# Altium schematic sheet Digitalizador_RPi.SchDoc
size A1; Organization: Altium Limited; Address1: L3, 12a Rodborough Rd; Address2: Frenchs Forest; Address3: NSW; Address4: Australia 2086
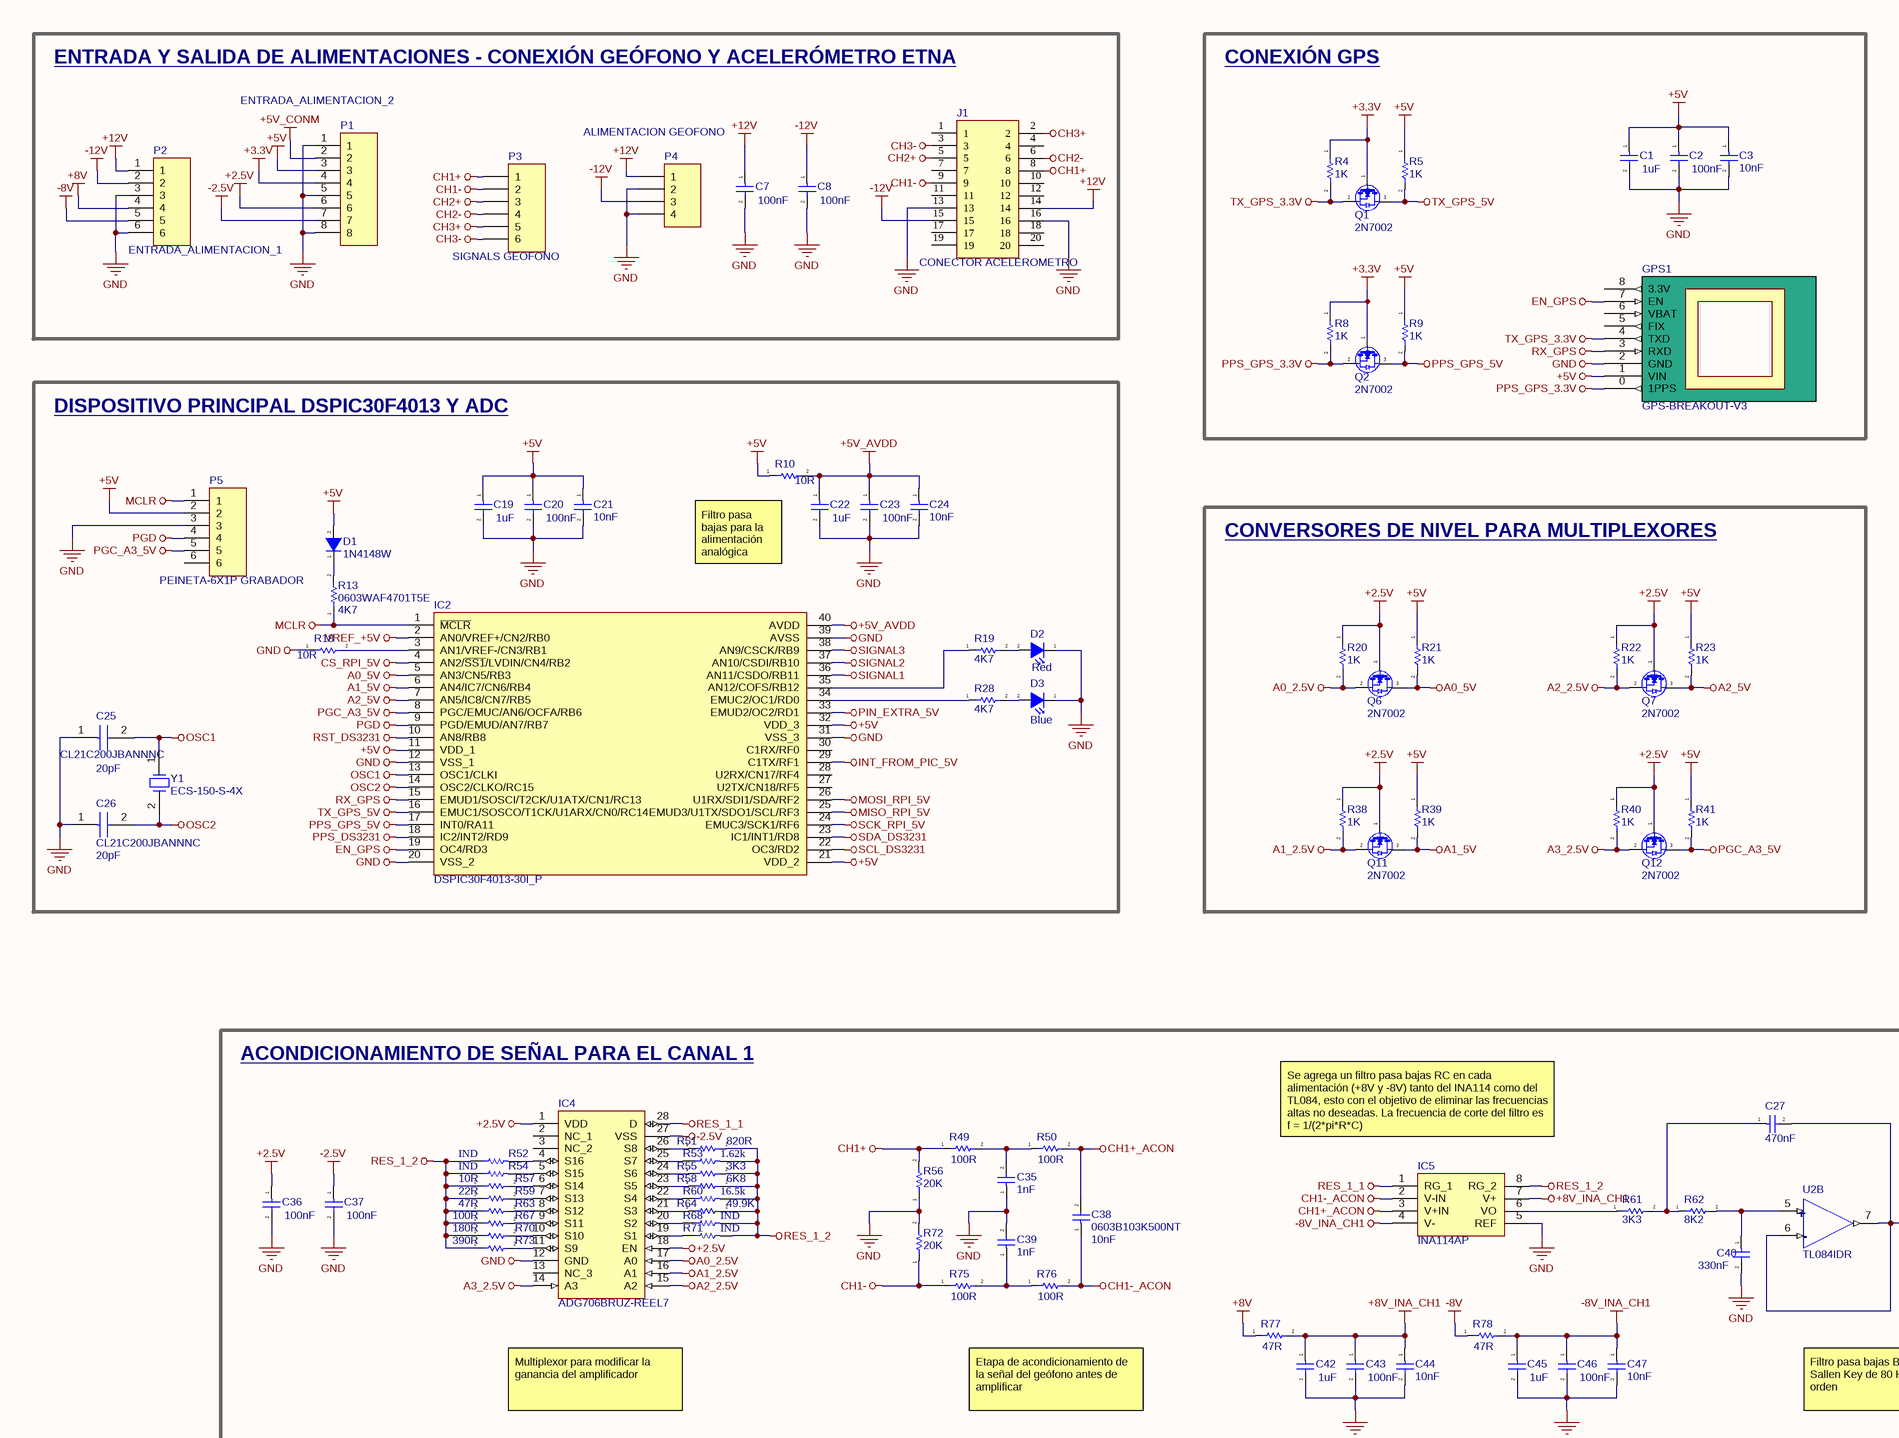
[diagram p0: Digitalizador_RPi.SchDoc, top left]
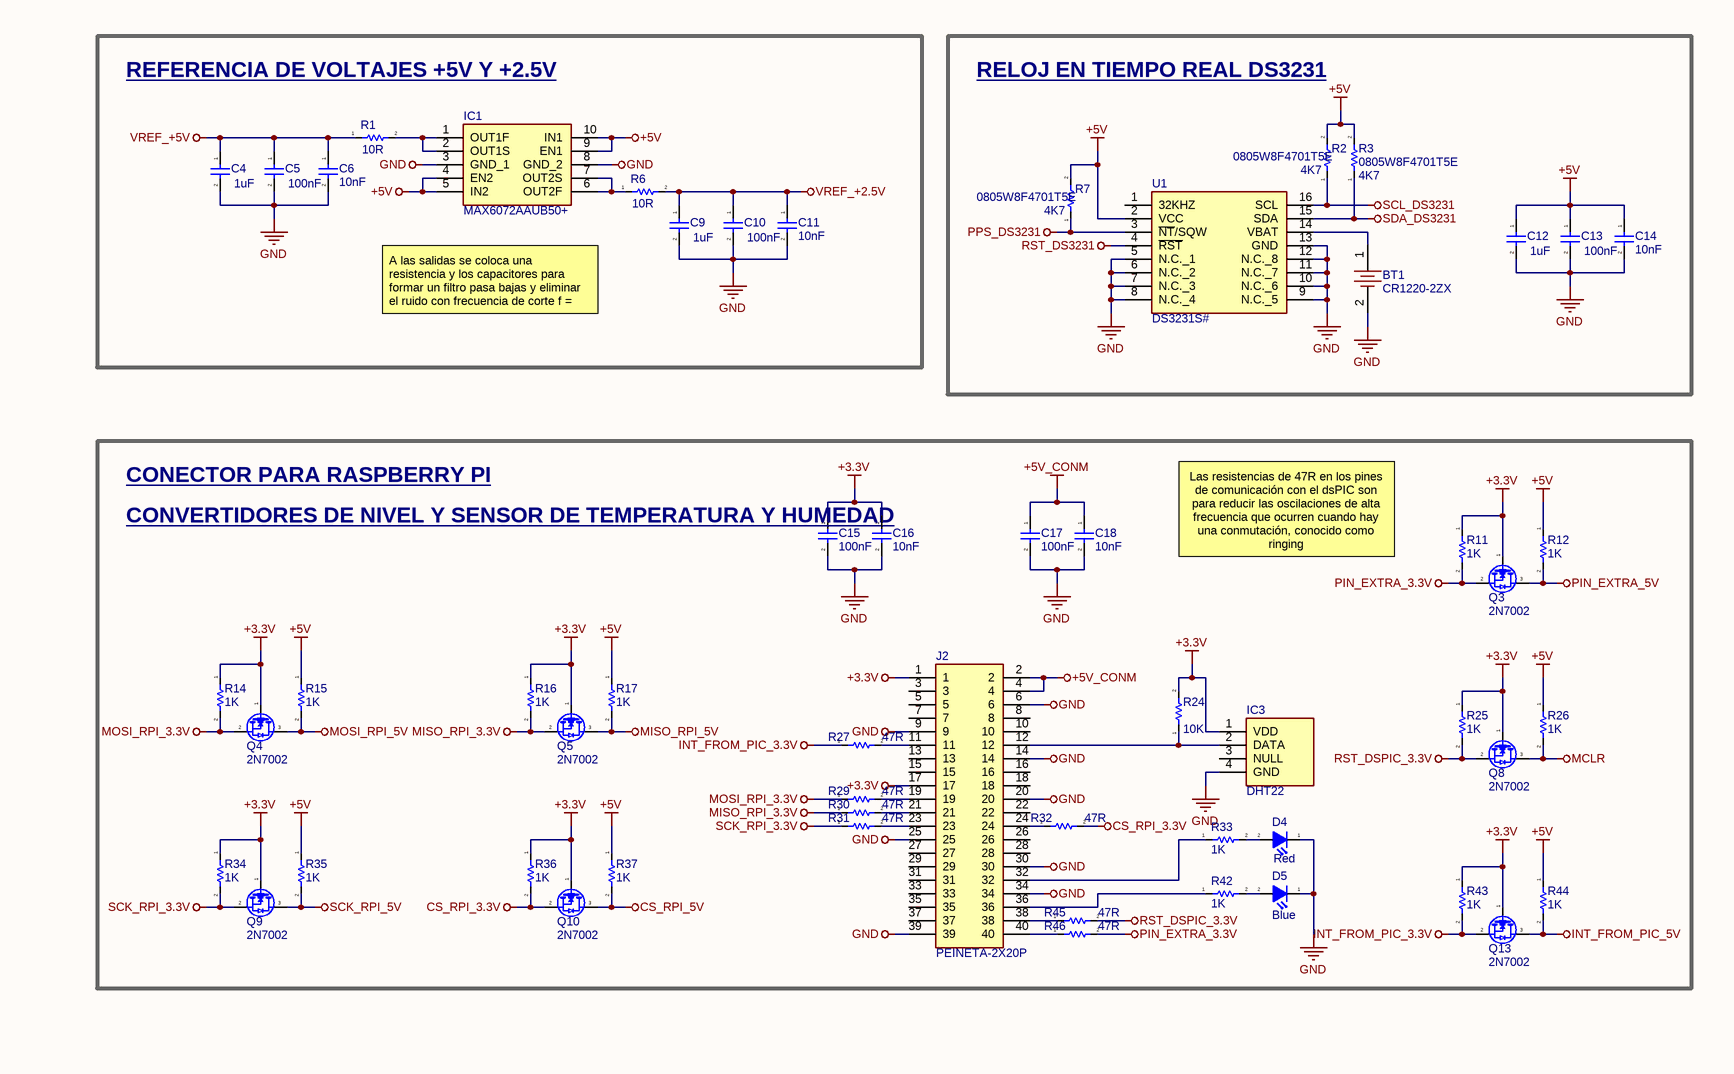
[diagram p1: Digitalizador_RPi.SchDoc, top right]
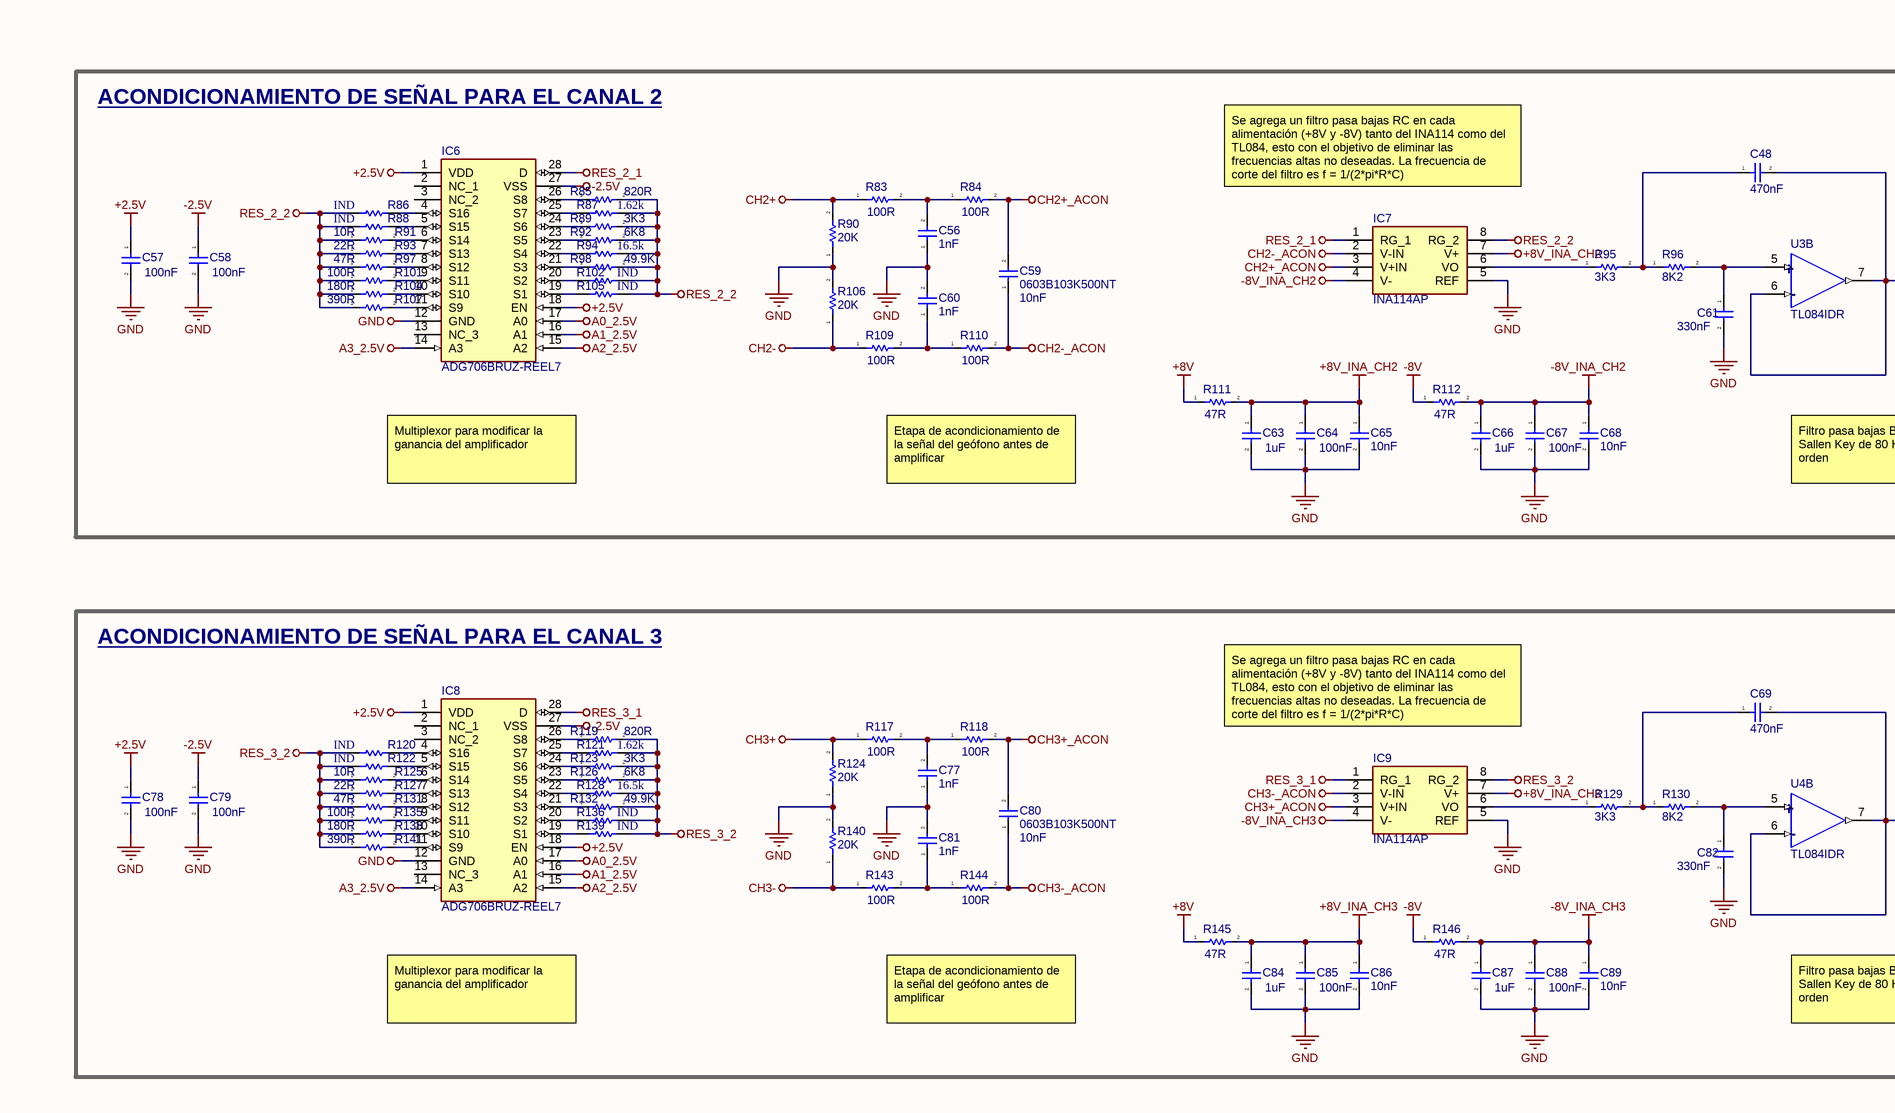
[diagram p2: Digitalizador_RPi.SchDoc, bottom left]
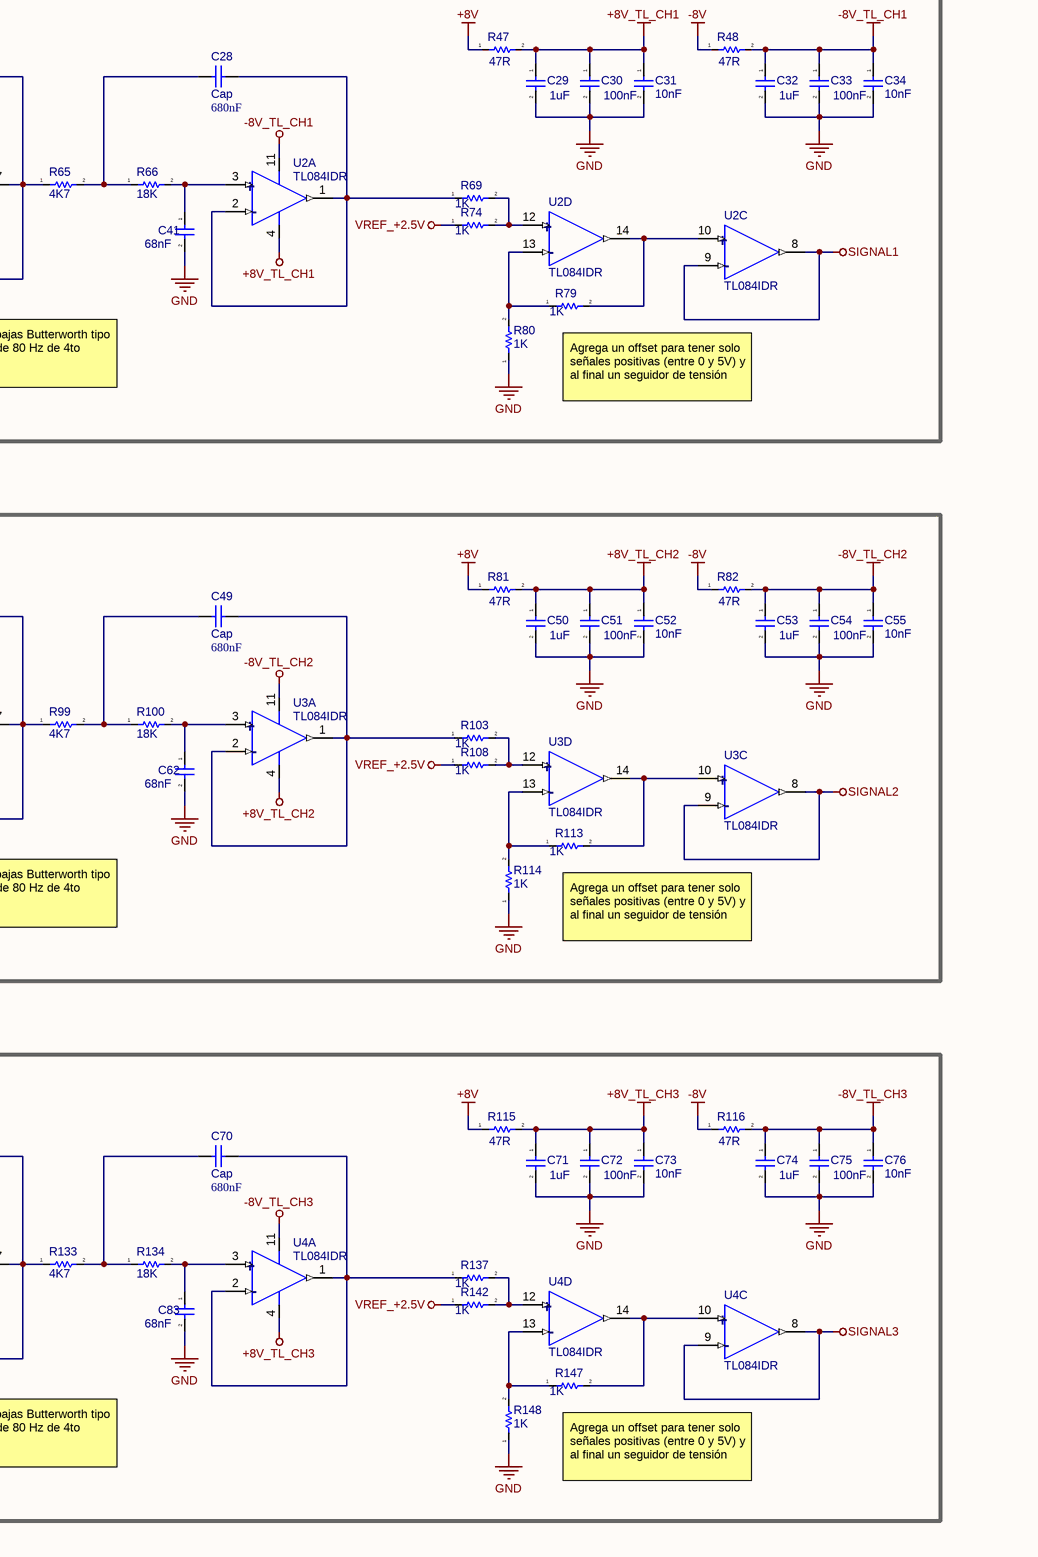
[diagram p3: Digitalizador_RPi.SchDoc, bottom right]

## Parts
BT1  CR1220-2ZX  [CR12202ZX]
C1  value 1uF  [CAPC1608X90N]  (hidden comment: CL10A105KB8NNNC)
C2  value 100nF  [CAPC1608X90N]  (hidden comment: CC0603KRX7R9BB104)
C3  value 10nF  [CAPC1608X90N]  (hidden comment: 0603B103K500NT)
C4  value 1uF  [CAPC1608X90N]  (hidden comment: CL10A105KB8NNNC)
C5  value 100nF  [CAPC1608X90N]  (hidden comment: CC0603KRX7R9BB104)
C6  value 10nF  [CAPC1608X90N]  (hidden comment: 0603B103K500NT)
C7  value 100nF  [CAPC1608X90N]  (hidden comment: CC0603KRX7R9BB104)
C8  value 100nF  [CAPC1608X90N]  (hidden comment: CC0603KRX7R9BB104)
C9  value 1uF  [CAPC1608X90N]  (hidden comment: CL10A105KB8NNNC)
C10  value 100nF  [CAPC1608X90N]  (hidden comment: CC0603KRX7R9BB104)
C11  value 10nF  [CAPC1608X90N]  (hidden comment: 0603B103K500NT)
C12  value 1uF  [CAPC1608X90N]  (hidden comment: CL10A105KB8NNNC)
C13  value 100nF  [CAPC1608X90N]  (hidden comment: CC0603KRX7R9BB104)
C14  value 10nF  [CAPC1608X90N]  (hidden comment: 0603B103K500NT)
C15  value 100nF  [CAPC1608X90N]  (hidden comment: CC0603KRX7R9BB104)
C16  value 10nF  [CAPC1608X90N]  (hidden comment: 0603B103K500NT)
C17  value 100nF  [CAPC1608X90N]  (hidden comment: CC0603KRX7R9BB104)
C18  value 10nF  [CAPC1608X90N]  (hidden comment: 0603B103K500NT)
C19  value 1uF  [CAPC1608X90N]  (hidden comment: CL10A105KB8NNNC)
C20  value 100nF  [CAPC1608X90N]  (hidden comment: CC0603KRX7R9BB104)
C21  value 10nF  [CAPC1608X90N]  (hidden comment: 0603B103K500NT)
C22  value 1uF  [CAPC1608X90N]  (hidden comment: CL10A105KB8NNNC)
C23  value 100nF  [CAPC1608X90N]  (hidden comment: CC0603KRX7R9BB104)
C24  value 10nF  [CAPC1608X90N]  (hidden comment: 0603B103K500NT)
C25  CL21C200JBANNNC  value 20pF  [CAPC2012X75N]
C26  CL21C200JBANNNC  value 20pF  [CAPC2012X75N]
C27  value 470nF  [CAPC1608X90N]  (hidden comment: CL10B474KA8NNNC)
C28  Cap  value 680nF  [CAPC1608X90N]
C29  value 1uF  [CAPC1608X90N]  (hidden comment: CL10A105KB8NNNC)
C30  value 100nF  [CAPC1608X90N]  (hidden comment: CC0603KRX7R9BB104)
C31  value 10nF  [CAPC1608X90N]  (hidden comment: 0603B103K500NT)
C32  value 1uF  [CAPC1608X90N]  (hidden comment: CL10A105KB8NNNC)
C33  value 100nF  [CAPC1608X90N]  (hidden comment: CC0603KRX7R9BB104)
C34  value 10nF  [CAPC1608X90N]  (hidden comment: 0603B103K500NT)
C35  value 1nF  [CAPC1608X90N]  (hidden comment: CL10B102KB8NNNC)
C36  value 100nF  [CAPC1608X90N]  (hidden comment: CC0603KRX7R9BB104)
C37  value 100nF  [CAPC1608X90N]  (hidden comment: CC0603KRX7R9BB104)
C38  0603B103K500NT  value 10nF  [CAPC1608X90N]
C39  value 1nF  [CAPC1608X90N]  (hidden comment: CL10B102KB8NNNC)
C40  value 330nF  [CAPC1608X90N]  (hidden comment: 0603B334K250NT)
C41  value 68nF  [CAPC1608X90N]  (hidden comment: CL10B683KB8NNNC)
C42  value 1uF  [CAPC1608X90N]  (hidden comment: CL10A105KB8NNNC)
C43  value 100nF  [CAPC1608X90N]  (hidden comment: CC0603KRX7R9BB104)
C44  value 10nF  [CAPC1608X90N]  (hidden comment: 0603B103K500NT)
C45  value 1uF  [CAPC1608X90N]  (hidden comment: CL10A105KB8NNNC)
C46  value 100nF  [CAPC1608X90N]  (hidden comment: CC0603KRX7R9BB104)
C47  value 10nF  [CAPC1608X90N]  (hidden comment: 0603B103K500NT)
C48  value 470nF  [CAPC1608X90N]  (hidden comment: CL10B474KA8NNNC)
C49  Cap  value 680nF  [CAPC1608X90N]
C50  value 1uF  [CAPC1608X90N]  (hidden comment: CL10A105KB8NNNC)
C51  value 100nF  [CAPC1608X90N]  (hidden comment: CC0603KRX7R9BB104)
C52  value 10nF  [CAPC1608X90N]  (hidden comment: 0603B103K500NT)
C53  value 1uF  [CAPC1608X90N]  (hidden comment: CL10A105KB8NNNC)
C54  value 100nF  [CAPC1608X90N]  (hidden comment: CC0603KRX7R9BB104)
C55  value 10nF  [CAPC1608X90N]  (hidden comment: 0603B103K500NT)
C56  value 1nF  [CAPC1608X90N]  (hidden comment: CL10B102KB8NNNC)
C57  value 100nF  [CAPC1608X90N]  (hidden comment: CC0603KRX7R9BB104)
C58  value 100nF  [CAPC1608X90N]  (hidden comment: CC0603KRX7R9BB104)
C59  0603B103K500NT  value 10nF  [CAPC1608X90N]
C60  value 1nF  [CAPC1608X90N]  (hidden comment: CL10B102KB8NNNC)
C61  value 330nF  [CAPC1608X90N]  (hidden comment: 0603B334K250NT)
C62  value 68nF  [CAPC1608X90N]  (hidden comment: CL10B683KB8NNNC)
C63  value 1uF  [CAPC1608X90N]  (hidden comment: CL10A105KB8NNNC)
C64  value 100nF  [CAPC1608X90N]  (hidden comment: CC0603KRX7R9BB104)
C65  value 10nF  [CAPC1608X90N]  (hidden comment: 0603B103K500NT)
C66  value 1uF  [CAPC1608X90N]  (hidden comment: CL10A105KB8NNNC)
C67  value 100nF  [CAPC1608X90N]  (hidden comment: CC0603KRX7R9BB104)
C68  value 10nF  [CAPC1608X90N]  (hidden comment: 0603B103K500NT)
C69  value 470nF  [CAPC1608X90N]  (hidden comment: CL10B474KA8NNNC)
C70  Cap  value 680nF  [CAPC1608X90N]
C71  value 1uF  [CAPC1608X90N]  (hidden comment: CL10A105KB8NNNC)
C72  value 100nF  [CAPC1608X90N]  (hidden comment: CC0603KRX7R9BB104)
C73  value 10nF  [CAPC1608X90N]  (hidden comment: 0603B103K500NT)
C74  value 1uF  [CAPC1608X90N]  (hidden comment: CL10A105KB8NNNC)
C75  value 100nF  [CAPC1608X90N]  (hidden comment: CC0603KRX7R9BB104)
C76  value 10nF  [CAPC1608X90N]  (hidden comment: 0603B103K500NT)
C77  value 1nF  [CAPC1608X90N]  (hidden comment: CL10B102KB8NNNC)
C78  value 100nF  [CAPC1608X90N]  (hidden comment: CC0603KRX7R9BB104)
C79  value 100nF  [CAPC1608X90N]  (hidden comment: CC0603KRX7R9BB104)
C80  0603B103K500NT  value 10nF  [CAPC1608X90N]
C81  value 1nF  [CAPC1608X90N]  (hidden comment: CL10B102KB8NNNC)
C82  value 330nF  [CAPC1608X90N]  (hidden comment: 0603B334K250NT)
C83  value 68nF  [CAPC1608X90N]  (hidden comment: CL10B683KB8NNNC)
C84  value 1uF  [CAPC1608X90N]  (hidden comment: CL10A105KB8NNNC)
C85  value 100nF  [CAPC1608X90N]  (hidden comment: CC0603KRX7R9BB104)
C86  value 10nF  [CAPC1608X90N]  (hidden comment: 0603B103K500NT)
C87  value 1uF  [CAPC1608X90N]  (hidden comment: CL10A105KB8NNNC)
C88  value 100nF  [CAPC1608X90N]  (hidden comment: CC0603KRX7R9BB104)
C89  value 10nF  [CAPC1608X90N]  (hidden comment: 0603B103K500NT)
D1  1N4148W  [SOD3716X135N]
D2  value Red  [LED-0805-R-RFS]  (hidden comment: NCD0805R1)
D3  value Blue  [LED-0805-B-RFS]  (hidden comment: XL-0805QBC)
D4  value Red  [LED-0805-R-RFS]  (hidden comment: NCD0805R1)
D5  value Blue  [LED-0805-B-RFS]  (hidden comment: XL-0805QBC)
GPS1  GPS-BREAKOUT-V3  [GPS-BREAKOUT-V3]
IC1  MAX6072AAUB50+  [SOP50P490X110-10N]
IC2  DSPIC30F4013-30I_P  [DIP1543W58P254L5175H635Q40N]
IC3  DHT22  [DHT22]
IC4  ADG706BRUZ-REEL7  [SOP65P640X120-28N]
IC5  INA114AP  [DIP794W53P254L959H508Q8N]
IC6  ADG706BRUZ-REEL7  [SOP65P640X120-28N]
IC7  INA114AP  [DIP794W53P254L959H508Q8N]
IC8  ADG706BRUZ-REEL7  [SOP65P640X120-28N]
IC9  INA114AP  [DIP794W53P254L959H508Q8N]
J1  CONECTOR ACELEROMETRO  [HDRV20W87P254_2X10_2553X508X864P]
J2  PEINETA-2X20P  [HDRV40W85P254_2X20_5080X500X860P]
P1  ENTRADA_ALIMENTACION_2  [SIP-8X1P-F-V]
P2  ENTRADA_ALIMENTACION_1  [SIP-6X1P-F-V]
P3  SIGNALS GEOFONO  [MOLEX-6P]
P4  ALIMENTACION GEOFONO  [MOLEX-4P]
P5  PEINETA-6X1P GRABADOR  [SIP-6X1P-M-V]
Q1  2N7002  [SOT96P240X120-3N]
Q2  2N7002  [SOT96P240X120-3N]
Q3  2N7002  [SOT96P240X120-3N]
Q4  2N7002  [SOT96P240X120-3N]
Q5  2N7002  [SOT96P240X120-3N]
Q6  2N7002  [SOT96P240X120-3N]
Q7  2N7002  [SOT96P240X120-3N]
Q8  2N7002  [SOT96P240X120-3N]
Q9  2N7002  [SOT96P240X120-3N]
Q10  2N7002  [SOT96P240X120-3N]
Q11  2N7002  [SOT96P240X120-3N]
Q12  2N7002  [SOT96P240X120-3N]
Q13  2N7002  [SOT96P240X120-3N]
R1  value 10R  [RESC2013X65N]  (hidden comment: 0805W8F100JT5E)
R2  0805W8F4701T5E  value 4K7  [RESC2012X50N]
R3  0805W8F4701T5E  value 4K7  [RESC2012X50N]
R4  value 1K  [RESC2012X50N]  (hidden comment: 0805W8F1001T5E)
R5  value 1K  [RESC2012X50N]  (hidden comment: 0805W8F1001T5E)
R6  value 10R  [RESC2013X65N]  (hidden comment: 0805W8F100JT5E)
R7  0805W8F4701T5E  value 4K7  [RESC2012X50N]
R8  value 1K  [RESC2012X50N]  (hidden comment: 0805W8F1001T5E)
R9  value 1K  [RESC2012X50N]  (hidden comment: 0805W8F1001T5E)
R10  value 10R  [RESC2013X65N]  (hidden comment: 0805W8F100JT5E)
R11  value 1K  [RESC2012X50N]  (hidden comment: 0805W8F1001T5E)
R12  value 1K  [RESC2012X50N]  (hidden comment: 0805W8F1001T5E)
R13  0603WAF4701T5E  value 4K7  [RES-0603-RFS]
R14  value 1K  [RESC2012X50N]  (hidden comment: 0805W8F1001T5E)
R15  value 1K  [RESC2012X50N]  (hidden comment: 0805W8F1001T5E)
R16  value 1K  [RESC2012X50N]  (hidden comment: 0805W8F1001T5E)
R17  value 1K  [RESC2012X50N]  (hidden comment: 0805W8F1001T5E)
R18  value 10R  [RESC2013X65N]  (hidden comment: 0805W8F100JT5E)
R19  value 4K7  [RESC2012X50N]  (hidden comment: 0805W8F4701T5E)
R20  value 1K  [RESC2012X50N]  (hidden comment: 0805W8F1001T5E)
R21  value 1K  [RESC2012X50N]  (hidden comment: 0805W8F1001T5E)
R22  value 1K  [RESC2012X50N]  (hidden comment: 0805W8F1001T5E)
R23  value 1K  [RESC2012X50N]  (hidden comment: 0805W8F1001T5E)
R24  value 10K  [RESC2012X50N]  (hidden comment: 0805W8F1002T5E)
R25  value 1K  [RESC2012X50N]  (hidden comment: 0805W8F1001T5E)
R26  value 1K  [RESC2012X50N]  (hidden comment: 0805W8F1001T5E)
R27  value 47R  [RESC2013X65N]  (hidden comment: 0805W8F470JT5E)
R28  value 4K7  [RESC2012X50N]  (hidden comment: 0805W8F4701T5E)
R29  value 47R  [RESC2013X65N]  (hidden comment: 0805W8F470JT5E)
R30  value 47R  [RESC2013X65N]  (hidden comment: 0805W8F470JT5E)
R31  value 47R  [RESC2013X65N]  (hidden comment: 0805W8F470JT5E)
R32  value 47R  [RESC2013X65N]  (hidden comment: 0805W8F470JT5E)
R33  value 1K  [RESC2012X50N]  (hidden comment: 0805W8F1001T5E)
R34  value 1K  [RESC2012X50N]  (hidden comment: 0805W8F1001T5E)
R35  value 1K  [RESC2012X50N]  (hidden comment: 0805W8F1001T5E)
R36  value 1K  [RESC2012X50N]  (hidden comment: 0805W8F1001T5E)
R37  value 1K  [RESC2012X50N]  (hidden comment: 0805W8F1001T5E)
R38  value 1K  [RESC2012X50N]  (hidden comment: 0805W8F1001T5E)
R39  value 1K  [RESC2012X50N]  (hidden comment: 0805W8F1001T5E)
R40  value 1K  [RESC2012X50N]  (hidden comment: 0805W8F1001T5E)
R41  value 1K  [RESC2012X50N]  (hidden comment: 0805W8F1001T5E)
R42  value 1K  [RESC2012X50N]  (hidden comment: 0805W8F1001T5E)
R43  value 1K  [RESC2012X50N]  (hidden comment: 0805W8F1001T5E)
R44  value 1K  [RESC2012X50N]  (hidden comment: 0805W8F1001T5E)
R45  value 47R  [RESC2013X65N]  (hidden comment: 0805W8F470JT5E)
R46  value 47R  [RESC2013X65N]  (hidden comment: 0805W8F470JT5E)
R47  value 47R  [RESC2013X65N]  (hidden comment: 0805W8F470JT5E)
R48  value 47R  [RESC2013X65N]  (hidden comment: 0805W8F470JT5E)
R49  value 100R  [RESC2013X65N]  (hidden comment: 0805W8F1000T5E)
R50  value 100R  [RESC2013X65N]  (hidden comment: 0805W8F1000T5E)
R51  value 820R  [RESC2013X65N]  (hidden comment: 0805W8F8200T5E)
R52  value IND  [6-0805_N]  (hidden comment: Res1)
R53  value 1.62k  [6-0805_N]  (hidden comment: Res1)
R54  value IND  [6-0805_N]  (hidden comment: Res1)
R55  value 3K3  [RESC2013X65N]  (hidden comment: 0805W8F3301T5E)
R56  value 20K  [RESC2012X50N]  (hidden comment: 0805W8F2002T5E)
R57  value 10R  [RESC2013X65N]  (hidden comment: 0805W8F100JT5E)
R58  value 6K8  [RESC2013X65N]  (hidden comment: 0805W8F6801T5E)
R59  value 22R  [RESC2013X65N]  (hidden comment: 0805W8F220JT5E)
R60  value 16.5k  [6-0805_N]  (hidden comment: Res1)
R61  value 3K3  [RESC2013X65N]  (hidden comment: 0805W8F3301T5E)
R62  value 8K2  [RESC2013X65N]  (hidden comment: 0805W8F8201T5E)
R63  value 47R  [RESC2013X65N]  (hidden comment: 0805W8F470JT5E)
R64  value 49.9K  [RESC2013X65N]  (hidden comment: 0805W8F4992T5E)
R65  value 4K7  [RESC2012X50N]  (hidden comment: 0805W8F4701T5E)
R66  value 18K  [RESC2013X65N]  (hidden comment: 0805W8F1802T5E)
R67  value 100R  [RESC2013X65N]  (hidden comment: 0805W8F1000T5E)
R68  value IND  [6-0805_N]  (hidden comment: Res1)
R69  value 1K  [RESC2012X50N]  (hidden comment: 0805W8F1001T5E)
R70  value 180R  [RESC2013X65N]  (hidden comment: 0805W8F1800T5E)
R71  value IND  [6-0805_N]  (hidden comment: Res1)
R72  value 20K  [RESC2012X50N]  (hidden comment: 0805W8F2002T5E)
R73  value 390R  [RESC2013X65N]  (hidden comment: 0805W8F3900T5E)
R74  value 1K  [RESC2012X50N]  (hidden comment: 0805W8F1001T5E)
R75  value 100R  [RESC2013X65N]  (hidden comment: 0805W8F1000T5E)
R76  value 100R  [RESC2013X65N]  (hidden comment: 0805W8F1000T5E)
R77  value 47R  [RESC2013X65N]  (hidden comment: 0805W8F470JT5E)
R78  value 47R  [RESC2013X65N]  (hidden comment: 0805W8F470JT5E)
R79  value 1K  [RESC2012X50N]  (hidden comment: 0805W8F1001T5E)
R80  value 1K  [RESC2012X50N]  (hidden comment: 0805W8F1001T5E)
R81  value 47R  [RESC2013X65N]  (hidden comment: 0805W8F470JT5E)
R82  value 47R  [RESC2013X65N]  (hidden comment: 0805W8F470JT5E)
R83  value 100R  [RESC2013X65N]  (hidden comment: 0805W8F1000T5E)
R84  value 100R  [RESC2013X65N]  (hidden comment: 0805W8F1000T5E)
R85  value 820R  [RESC2013X65N]  (hidden comment: 0805W8F8200T5E)
R86  value IND  [6-0805_N]  (hidden comment: Res1)
R87  value 1.62k  [6-0805_N]  (hidden comment: Res1)
R88  value IND  [6-0805_N]  (hidden comment: Res1)
R89  value 3K3  [RESC2013X65N]  (hidden comment: 0805W8F3301T5E)
R90  value 20K  [RESC2012X50N]  (hidden comment: 0805W8F2002T5E)
R91  value 10R  [RESC2013X65N]  (hidden comment: 0805W8F100JT5E)
R92  value 6K8  [RESC2013X65N]  (hidden comment: 0805W8F6801T5E)
R93  value 22R  [RESC2013X65N]  (hidden comment: 0805W8F220JT5E)
R94  value 16.5k  [6-0805_N]  (hidden comment: Res1)
R95  value 3K3  [RESC2013X65N]  (hidden comment: 0805W8F3301T5E)
R96  value 8K2  [RESC2013X65N]  (hidden comment: 0805W8F8201T5E)
R97  value 47R  [RESC2013X65N]  (hidden comment: 0805W8F470JT5E)
R98  value 49.9K  [RESC2013X65N]  (hidden comment: 0805W8F4992T5E)
R99  value 4K7  [RESC2012X50N]  (hidden comment: 0805W8F4701T5E)
R100  value 18K  [RESC2013X65N]  (hidden comment: 0805W8F1802T5E)
R101  value 100R  [RESC2013X65N]  (hidden comment: 0805W8F1000T5E)
R102  value IND  [6-0805_N]  (hidden comment: Res1)
R103  value 1K  [RESC2012X50N]  (hidden comment: 0805W8F1001T5E)
R104  value 180R  [RESC2013X65N]  (hidden comment: 0805W8F1800T5E)
R105  value IND  [6-0805_N]  (hidden comment: Res1)
R106  value 20K  [RESC2012X50N]  (hidden comment: 0805W8F2002T5E)
R107  value 390R  [RESC2013X65N]  (hidden comment: 0805W8F3900T5E)
R108  value 1K  [RESC2012X50N]  (hidden comment: 0805W8F1001T5E)
R109  value 100R  [RESC2013X65N]  (hidden comment: 0805W8F1000T5E)
R110  value 100R  [RESC2013X65N]  (hidden comment: 0805W8F1000T5E)
R111  value 47R  [RESC2013X65N]  (hidden comment: 0805W8F470JT5E)
R112  value 47R  [RESC2013X65N]  (hidden comment: 0805W8F470JT5E)
R113  value 1K  [RESC2012X50N]  (hidden comment: 0805W8F1001T5E)
R114  value 1K  [RESC2012X50N]  (hidden comment: 0805W8F1001T5E)
R115  value 47R  [RESC2013X65N]  (hidden comment: 0805W8F470JT5E)
R116  value 47R  [RESC2013X65N]  (hidden comment: 0805W8F470JT5E)
R117  value 100R  [RESC2013X65N]  (hidden comment: 0805W8F1000T5E)
R118  value 100R  [RESC2013X65N]  (hidden comment: 0805W8F1000T5E)
R119  value 820R  [RESC2013X65N]  (hidden comment: 0805W8F8200T5E)
R120  value IND  [6-0805_N]  (hidden comment: Res1)
R121  value 1.62k  [6-0805_N]  (hidden comment: Res1)
R122  value IND  [6-0805_N]  (hidden comment: Res1)
R123  value 3K3  [RESC2013X65N]  (hidden comment: 0805W8F3301T5E)
R124  value 20K  [RESC2012X50N]  (hidden comment: 0805W8F2002T5E)
R125  value 10R  [RESC2013X65N]  (hidden comment: 0805W8F100JT5E)
R126  value 6K8  [RESC2013X65N]  (hidden comment: 0805W8F6801T5E)
R127  value 22R  [RESC2013X65N]  (hidden comment: 0805W8F220JT5E)
R128  value 16.5k  [6-0805_N]  (hidden comment: Res1)
R129  value 3K3  [RESC2013X65N]  (hidden comment: 0805W8F3301T5E)
R130  value 8K2  [RESC2013X65N]  (hidden comment: 0805W8F8201T5E)
R131  value 47R  [RESC2013X65N]  (hidden comment: 0805W8F470JT5E)
R132  value 49.9K  [RESC2013X65N]  (hidden comment: 0805W8F4992T5E)
R133  value 4K7  [RESC2012X50N]  (hidden comment: 0805W8F4701T5E)
R134  value 18K  [RESC2013X65N]  (hidden comment: 0805W8F1802T5E)
R135  value 100R  [RESC2013X65N]  (hidden comment: 0805W8F1000T5E)
R136  value IND  [6-0805_N]  (hidden comment: Res1)
R137  value 1K  [RESC2012X50N]  (hidden comment: 0805W8F1001T5E)
R138  value 180R  [RESC2013X65N]  (hidden comment: 0805W8F1800T5E)
R139  value IND  [6-0805_N]  (hidden comment: Res1)
R140  value 20K  [RESC2012X50N]  (hidden comment: 0805W8F2002T5E)
R141  value 390R  [RESC2013X65N]  (hidden comment: 0805W8F3900T5E)
R142  value 1K  [RESC2012X50N]  (hidden comment: 0805W8F1001T5E)
R143  value 100R  [RESC2013X65N]  (hidden comment: 0805W8F1000T5E)
R144  value 100R  [RESC2013X65N]  (hidden comment: 0805W8F1000T5E)
R145  value 47R  [RESC2013X65N]  (hidden comment: 0805W8F470JT5E)
R146  value 47R  [RESC2013X65N]  (hidden comment: 0805W8F470JT5E)
R147  value 1K  [RESC2012X50N]  (hidden comment: 0805W8F1001T5E)
R148  value 1K  [RESC2012X50N]  (hidden comment: 0805W8F1001T5E)
U1  DS3231S#  [SOIC127P1032X265-16N]
U2  TL084IDR  [SOIC127P600X175-14N]  (parts A,B,C,D of 4)
U3  TL084IDR  [SOIC127P600X175-14N]  (parts A,B,C,D of 4)
U4  TL084IDR  [SOIC127P600X175-14N]  (parts A,B,C,D of 4)
Y1  ECS-150-S-4X  [ECS150S4X]

## Blocks framed on the sheet
CONEXIÓN GPS: C1-C3 GPS1 Q1 Q2 R4 R5 R8 R9
REFERENCIA DE VOLTAJES +5V Y +2.5V: C4-C6 C9-C11 IC1 R1 R6
RELOJ EN TIEMPO REAL DS3231: BT1 C12-C14 R2 R3 R7 U1
DISPOSITIVO PRINCIPAL DSPIC30F4013 Y ADC: C19-C26 D1-D3 IC2 P5 R10 R13 R18 R19 R28 Y1
CONVERSORES DE NIVEL PARA MULTIPLEXORES: Q6 Q7 Q11 Q12 R20-R23 R38-R41
ACONDICIONAMIENTO DE SEÑAL PARA EL CANAL 1: C27-C47 IC4 IC5 R47-R80 U2
ACONDICIONAMIENTO DE SEÑAL PARA EL CANAL 2: C48-C68 IC6 IC7 R81-R114 U3
ACONDICIONAMIENTO DE SEÑAL PARA EL CANAL 3: C69-C89 IC8 IC9 R115-R148 U4

## Nets
+2.5V: C36.1 C57.1 C78.1 IC4.1(VDD) IC4.18(EN) IC6.1(VDD) IC6.18(EN) IC8.1(VDD) IC8.18(EN) P1.6 Q6.1(G) Q7.1(G) Q11.1(G) Q12.1(G) R20.1 R22.1 R38.1 R40.1
+3.3V: C15.1 C16.1 IC3.1(VDD) J2.1 J2.17 P1.4 Q1.1(G) Q2.1(G) Q3.1(G) Q4.1(G) Q5.1(G) Q8.1(G) Q9.1(G) Q10.1(G) Q13.1(G) R4.1 R8.1 R11.1 R14.1 R16.1 R24.2 R25.1 R34.1 R36.1 R43.1
+5V: C1.1 C2.1 C3.1 C12.1 C13.1 C14.1 C19.1 C20.1 C21.1 D1.2(A) GPS1.1(VIN) IC1.4(EN2) IC1.5(IN2) IC1.9(EN1) IC1.10(IN1) IC2.11(VDD_1) IC2.21(VDD_2) IC2.32(VDD_3) P1.3 P5.2 R2.2 R3.2 R5.1 R7.2 R9.1 R10.1 R12.1 R15.1 R17.1 R21.1 R23.1 R26.1 R35.1 R37.1 R39.1 R41.1 R44.1 U1.2(VCC)
+5V_AVDD: C22.1 C23.1 C24.1 IC2.40(AVDD) R10.2
+5V_CONM: C17.1 C18.1 J2.2 J2.4 P1.2
+8V: P2.4 R47.1 R77.1 R81.1 R111.1 R115.1 R145.1
+8V_INA_CH1: C42.1 C43.1 C44.1 IC5.7(V+) R77.2
+8V_INA_CH2: C63.1 C64.1 C65.1 IC7.7(V+) R111.2
+8V_INA_CH3: C84.1 C85.1 C86.1 IC9.7(V+) R145.2
+8V_TL_CH1: C29.1 C30.1 C31.1 R47.2 U2.4(VCC+)
+8V_TL_CH2: C50.1 C51.1 C52.1 R81.2 U3.4(VCC+)
+8V_TL_CH3: C71.1 C72.1 C73.1 R115.2 U4.4(VCC+)
+12V: C7.1 J1.14 P2.1 P4.1
-2.5V: C37.1 C58.1 C79.1 IC4.27(VSS) IC6.27(VSS) IC8.27(VSS) P1.7
-8V: P2.5 R48.1 R78.1 R82.1 R112.1 R116.1 R146.1
-8V_INA_CH1: C45.1 C46.1 C47.1 IC5.4(V-) R78.2
-8V_INA_CH2: C66.1 C67.1 C68.1 IC7.4(V-) R112.2
-8V_INA_CH3: C87.1 C88.1 C89.1 IC9.4(V-) R146.2
-8V_TL_CH1: C32.1 C33.1 C34.1 R48.2 U2.11(VCC-)
-8V_TL_CH2: C53.1 C54.1 C55.1 R82.2 U3.11(VCC-)
-8V_TL_CH3: C74.1 C75.1 C76.1 R116.2 U4.11(VCC-)
-12V: C8.1 J1.15 P2.2 P4.3
A0_2.5V: IC4.17(A0) IC6.17(A0) IC8.17(A0) Q6.2(S) R20.2
A0_5V: IC2.5(AN3/CN5/RB3) Q6.3(D) R21.2
A1_2.5V: IC4.16(A1) IC6.16(A1) IC8.16(A1) Q11.2(S) R38.2
A1_5V: IC2.6(AN4/IC7/CN6/RB4) Q11.3(D) R39.2
A2_2.5V: IC4.15(A2) IC6.15(A2) IC8.15(A2) Q7.2(S) R22.2
A2_5V: IC2.7(AN5/IC8/CN7/RB5) Q7.3(D) R23.2
A3_2.5V: IC4.14(A3) IC6.14(A3) IC8.14(A3) Q12.2(S) R40.2
CH1+: J1.8 P3.1 R49.1 R56.2
CH1+_ACON: C38.2 IC5.3(V+IN) R50.2
CH1-: J1.9 P3.2 R72.1 R75.1
CH1-_ACON: C38.1 IC5.2(V-IN) R76.2
CH2+: J1.5 P3.3 R83.1 R90.2
CH2+_ACON: C59.2 IC7.3(V+IN) R84.2
CH2-: J1.6 P3.4 R106.1 R109.1
CH2-_ACON: C59.1 IC7.2(V-IN) R110.2
CH3+: J1.2 P3.5 R117.1 R124.2
CH3+_ACON: C80.2 IC9.3(V+IN) R118.2
CH3-: J1.3 P3.6 R140.1 R143.1
CH3-_ACON: C80.1 IC9.2(V-IN) R144.2
CS_RPI_3.3V: Q10.2(S) R32.2 R36.2
CS_RPI_5V: IC2.4(AN2/~{SS1}/LVDIN/CN4/RB2) Q10.3(D) R37.2
EN_GPS: GPS1.7(EN) IC2.19(OC4/RD3)
GND: BT1.2 C1.2 C2.2 C3.2 C4.2 C5.2 C6.2 C7.2 C8.2 C9.2 C10.2 C11.2 C12.2 C13.2 C14.2 C15.2 C16.2 C17.2 C18.2 C19.2 C20.2 C21.2 C22.2 C23.2 C24.2 C25.1 C26.1 C29.2 C30.2 C31.2 C32.2 C33.2 C34.2 C35.1 C36.2 C37.2 C39.2 C40.2 C41.2 C42.2 C43.2 C44.2 C45.2 C46.2 C47.2 C50.2 C51.2 C52.2 C53.2 C54.2 C55.2 C56.1 C57.2 C58.2 C60.2 C61.2 C62.2 C63.2 C64.2 C65.2 C66.2 C67.2 C68.2 C71.2 C72.2 C73.2 C74.2 C75.2 C76.2 C77.1 C78.2 C79.2 C81.2 C82.2 C83.2 C84.2 C85.2 C86.2 C87.2 C88.2 C89.2 D2.1(K) D3.1(K) D4.1(K) D5.1(K) GPS1.2(GND) IC1.3(GND_1) IC1.8(GND_2) IC2.12(VSS_1) IC2.20(VSS_2) IC2.31(VSS_3) IC2.39(AVSS) IC3.4(GND) IC4.12(GND) IC5.5(REF) IC6.12(GND) IC7.5(REF) IC8.12(GND) IC9.5(REF) J1.13 J1.16 J2.6 J2.9 J2.14 J2.20 J2.25 J2.30 J2.34 J2.39 P1.1 P1.5 P1.8 P2.3 P2.6 P4.2 P4.4 P5.3 R18.1 R56.1 R72.2 R80.1 R90.1 R106.2 R114.1 R124.1 R140.2 R148.1 U1.5(N.C._1) U1.6(N.C._2) U1.7(N.C._3) U1.8(N.C._4) U1.9(N.C._5) U1.10(N.C._6) U1.11(N.C._7) U1.12(N.C._8) U1.13(GND)
INT_FROM_PIC_3.3V: Q13.2(S) R27.1 R43.2
INT_FROM_PIC_5V: IC2.29(C1TX/RF1) Q13.3(D) R44.2
MCLR: IC2.1(~{MCLR}) P5.1 Q8.3(D) R13.1 R26.2
MISO_RPI_3.3V: Q5.2(S) R16.2 R30.1
MISO_RPI_5V: IC2.25(EMUD3/U1TX/SDO1/SCL/RF3) Q5.3(D) R17.2
MOSI_RPI_3.3V: Q4.2(S) R14.2 R29.1
MOSI_RPI_5V: IC2.26(U1RX/SDI1/SDA/RF2) Q4.3(D) R15.2
OSC1: C25.2 IC2.13(OSC1/CLKI) Y1.1(CRYSTAL_1)
OSC2: C26.2 IC2.14(OSC2/CLKO/RC15) Y1.2(CRYSTAL_2)
PGC_A3_5V: IC2.8(PGC/EMUC/AN6/OCFA/RB6) P5.5 Q12.3(D) R41.2
PGD: IC2.9(PGD/EMUD/AN7/RB7) P5.4
PIN_EXTRA_3.3V: Q3.2(S) R11.2 R46.2
PIN_EXTRA_5V: IC2.33(EMUD2/OC2/RD1) Q3.3(D) R12.2
PPS_DS3231: IC2.18(IC2/INT2/RD9) R7.1 U1.3(~{NT}/SQW)
PPS_GPS_3.3V: GPS1.0(1PPS) Q2.2(S) R8.2
PPS_GPS_5V: IC2.17(INT0/RA11) Q2.3(D) R9.2
RES_1_1: IC4.28(D) IC5.1(RG_1)
RES_1_2: IC5.8(RG_2) R51.2 R52.1 R53.2 R54.1 R55.2 R57.1 R58.2 R59.1 R60.2 R63.1 R64.2 R67.1 R68.2 R70.1 R71.2 R73.1
RES_2_1: IC6.28(D) IC7.1(RG_1)
RES_2_2: IC7.8(RG_2) R85.2 R86.1 R87.2 R88.1 R89.2 R91.1 R92.2 R93.1 R94.2 R97.1 R98.2 R101.1 R102.2 R104.1 R105.2 R107.1
RES_3_1: IC8.28(D) IC9.1(RG_1)
RES_3_2: IC9.8(RG_2) R119.2 R120.1 R121.2 R122.1 R123.2 R125.1 R126.2 R127.1 R128.2 R131.1 R132.2 R135.1 R136.2 R138.1 R139.2 R141.1
RST_DS3231: IC2.10(AN8/RB8) U1.4(~{RST})
RST_DSPIC_3.3V: Q8.2(S) R25.2 R45.2
RX_GPS: GPS1.3(RXD) IC2.15(EMUD1/SOSCI/T2CK/U1ATX/CN1/RC13)
SCK_RPI_3.3V: Q9.2(S) R31.1 R34.2
SCK_RPI_5V: IC2.24(EMUC3/SCK1/RF6) Q9.3(D) R35.2
SCL_DS3231: IC2.22(OC3/RD2) R2.1 U1.16(SCL)
SDA_DS3231: IC2.23(IC1/INT1/RD8) R3.1 U1.15(SDA)
SIGNAL1: IC2.36(AN11/CSDO/RB11) U2.8(3OUT) U2.9(3IN-)
SIGNAL2: IC2.37(AN10/CSDI/RB10) U3.8(3OUT) U3.9(3IN-)
SIGNAL3: IC2.38(AN9/CSCK/RB9) U4.8(3OUT) U4.9(3IN-)
TX_GPS_3.3V: GPS1.4(TXD) Q1.2(S) R4.2
TX_GPS_5V: IC2.16(EMUC1/SOSCO/T1CK/U1ARX/CN0/RC14) Q1.3(D) R5.2
VREF_+2.5V: C9.1 C10.1 C11.1 R6.2 R74.1 R108.1 R142.1
VREF_+5V: C4.1 C5.1 C6.1 IC2.2(AN0/VREF+/CN2/RB0) R1.1
NetBT1_1: BT1.1 U1.14(VBAT)
NetC27_1: C27.1 R61.2 R62.1
NetC27_2: C27.2 R65.1 U2.6(2IN-) U2.7(2OUT)
NetC28_1: C28.1 R65.2 R66.1
NetC28_2: C28.2 R69.1 U2.1(1OUT) U2.2(1IN-)
NetC35_2: C35.2 R49.2 R50.1
NetC39_1: C39.1 R75.2 R76.1
NetC40_1: C40.1 R62.2 U2.5(2IN+)
NetC41_1: C41.1 R66.2 U2.3(1IN+)
NetC48_1: C48.1 R95.2 R96.1
NetC48_2: C48.2 R99.1 U3.6(2IN-) U3.7(2OUT)
NetC49_1: C49.1 R99.2 R100.1
NetC49_2: C49.2 R103.1 U3.1(1OUT) U3.2(1IN-)
NetC56_2: C56.2 R83.2 R84.1
NetC60_1: C60.1 R109.2 R110.1
NetC61_1: C61.1 R96.2 U3.5(2IN+)
NetC62_1: C62.1 R100.2 U3.3(1IN+)
NetC69_1: C69.1 R129.2 R130.1
NetC69_2: C69.2 R133.1 U4.6(2IN-) U4.7(2OUT)
NetC70_1: C70.1 R133.2 R134.1
NetC70_2: C70.2 R137.1 U4.1(1OUT) U4.2(1IN-)
NetC77_2: C77.2 R117.2 R118.1
NetC81_1: C81.1 R143.2 R144.1
NetC82_1: C82.1 R130.2 U4.5(2IN+)
NetC83_1: C83.1 R134.2 U4.3(1IN+)
NetD1_1: D1.1(K) R13.2
NetD2_2: D2.2(A) R19.2
NetD3_2: D3.2(A) R28.2
NetD4_2: D4.2(A) R33.2
NetD5_2: D5.2(A) R42.2
NetIC1_1: IC1.1(OUT1F) IC1.2(OUT1S) R1.2
NetIC1_6: IC1.6(OUT2F) IC1.7(OUT2S) R6.1
NetIC2_3: IC2.3(AN1/VREF-/CN3/RB1) R18.2
NetIC2_34: IC2.34(EMUC2/OC1/RD0) R28.1
NetIC2_35: IC2.35(AN12/COFS/RB12) R19.1
NetIC3_2: IC3.2(DATA) J2.12 R24.1
NetIC4_4: IC4.4(S16) R52.2
NetIC4_5: IC4.5(S15) R54.2
NetIC4_6: IC4.6(S14) R57.2
NetIC4_7: IC4.7(S13) R59.2
NetIC4_8: IC4.8(S12) R63.2
NetIC4_9: IC4.9(S11) R67.2
NetIC4_10: IC4.10(S10) R70.2
NetIC4_11: IC4.11(S9) R73.2
NetIC4_19: IC4.19(S1) R71.1
NetIC4_20: IC4.20(S2) R68.1
NetIC4_21: IC4.21(S3) R64.1
NetIC4_22: IC4.22(S4) R60.1
NetIC4_23: IC4.23(S5) R58.1
NetIC4_24: IC4.24(S6) R55.1
NetIC4_25: IC4.25(S7) R53.1
NetIC4_26: IC4.26(S8) R51.1
NetIC5_6: IC5.6(VO) R61.1
NetIC6_4: IC6.4(S16) R86.2
NetIC6_5: IC6.5(S15) R88.2
NetIC6_6: IC6.6(S14) R91.2
NetIC6_7: IC6.7(S13) R93.2
NetIC6_8: IC6.8(S12) R97.2
NetIC6_9: IC6.9(S11) R101.2
NetIC6_10: IC6.10(S10) R104.2
NetIC6_11: IC6.11(S9) R107.2
NetIC6_19: IC6.19(S1) R105.1
NetIC6_20: IC6.20(S2) R102.1
NetIC6_21: IC6.21(S3) R98.1
NetIC6_22: IC6.22(S4) R94.1
NetIC6_23: IC6.23(S5) R92.1
NetIC6_24: IC6.24(S6) R89.1
NetIC6_25: IC6.25(S7) R87.1
NetIC6_26: IC6.26(S8) R85.1
NetIC7_6: IC7.6(VO) R95.1
NetIC8_4: IC8.4(S16) R120.2
NetIC8_5: IC8.5(S15) R122.2
NetIC8_6: IC8.6(S14) R125.2
NetIC8_7: IC8.7(S13) R127.2
NetIC8_8: IC8.8(S12) R131.2
NetIC8_9: IC8.9(S11) R135.2
NetIC8_10: IC8.10(S10) R138.2
NetIC8_11: IC8.11(S9) R141.2
NetIC8_19: IC8.19(S1) R139.1
NetIC8_20: IC8.20(S2) R136.1
NetIC8_21: IC8.21(S3) R132.1
NetIC8_22: IC8.22(S4) R128.1
NetIC8_23: IC8.23(S5) R126.1
NetIC8_24: IC8.24(S6) R123.1
NetIC8_25: IC8.25(S7) R121.1
NetIC8_26: IC8.26(S8) R119.1
NetIC9_6: IC9.6(VO) R129.1
NetJ2_11: J2.11 R27.2
NetJ2_19: J2.19 R29.2
NetJ2_21: J2.21 R30.2
NetJ2_23: J2.23 R31.2
NetJ2_24: J2.24 R32.1
NetJ2_32: J2.32 R33.1
NetJ2_36: J2.36 R42.1
NetJ2_38: J2.38 R45.1
NetJ2_40: J2.40 R46.1
NetR69_2: R69.2 R74.2 U2.12(4IN+)
NetR79_1: R79.1 R80.2 U2.13(4IN-)
NetR79_2: R79.2 U2.10(3IN+) U2.14(4OUT)
NetR103_2: R103.2 R108.2 U3.12(4IN+)
NetR113_1: R113.1 R114.2 U3.13(4IN-)
NetR113_2: R113.2 U3.10(3IN+) U3.14(4OUT)
NetR137_2: R137.2 R142.2 U4.12(4IN+)
NetR147_1: R147.1 R148.2 U4.13(4IN-)
NetR147_2: R147.2 U4.10(3IN+) U4.14(4OUT)

Not connected (* = marked no-connect by the designer): GPS1 5(FIX) 6(VBAT) 8(3.3V); IC2 27(U2TX/CN18/RF5) 28(U2RX/CN17/RF4) 30(C1RX/RF0); IC3 3(NULL); IC4 2(NC_1) 3(NC_2) 13(NC_3); IC6 2(NC_1) 3(NC_2) 13(NC_3); IC8 2(NC_1) 3(NC_2) 13(NC_3); J1 1 4 7 10 11 12 17 18 19 20; J2 3 5 7 8 10 13 15 16 18 22 26 27 28 29 31 33 35 37; P5 6; U1 1(32KHZ)

## Notes on the sheet
- ENTRADA Y SALIDA DE ALIMENTACIONES - CONEXIÓN GEÓFONO Y ACELERÓMETRO ETNA
- A las salidas se coloca una resistencia y los capacitores para formar un filtro pasa bajas y eliminar el ruido con frecuencia de corte f = 1/(2*pi*R*C)
- CONECTOR PARA RASPBERRY PI
- CONVERTIDORES DE NIVEL Y SENSOR DE TEMPERATURA Y HUMEDAD
- Las resistencias de 47R en los pines de comunicación con el dsPIC son para reducir las oscilaciones de alta frecuencia que ocurren cuando hay una conmutación, conocido como ringing
- Filtro pasa bajas para la alimentación analógica
- Se agrega un filtro pasa bajas RC en cada alimentación (+8V y -8V) tanto del INA114 como del TL084, esto con el objetivo de eliminar las frecuencias altas no deseadas. La frecuencia de corte del filtro es f = 1/(2*pi*R*C)
- Multiplexor para modificar la ganancia del amplificador
- Etapa de acondicionamiento de la señal del geófono antes de amplificar
- Filtro pasa bajas Butterworth tipo Sallen Key de 80 Hz de 4to orden
- (near R79) Agrega un offset para tener solo señales positivas (entre 0 y 5V) y al final un seguidor de tensión
- (near R113) Agrega un offset para tener solo señales positivas (entre 0 y 5V) y al final un seguidor de tensión
- (near R147) Agrega un offset para tener solo señales positivas (entre 0 y 5V) y al final un seguidor de tensión
- Title
- Size:
- Date:
- File:
- A1
- Number:
- Time:
- Revision:
- Sheet
- of
- (in symbol TL084IDR, part A) +; -
- (in symbol TL084IDR, part B) +; -
- (in symbol TL084IDR, part C) +; -
- (in symbol TL084IDR, part D) +; -

## Library data of the parts
BT1 = CR1220-2ZX: Battery Holder; Manufacturer_Name: Q&J; Info: SMD Battery Box/Battery Holders ROHS; Datasheet Link: https://datasheet.lcsc.com/lcsc/2101071835_Q&J-CR1220-2ZX_C969906.pdf; Height: 4mm; Manufacturer_Part_Number: CR1220-2ZX; JLCPCB Part #: C969906; JLCPCB Basic: No; JLCPCB Price: 0.2596; Package: BAT-SMD
C1 C4 C9 C12 C19 C22 C29 C32 C42 C45 C50 C53 C63 C66 C71 C74 C84 C87 = CL10A105KB8NNNC: Capacitor; Manufacturer_Name: Samsung Electro-Mechanics; Datasheet Link: http://www.samsungsem.com/kr/support/product-search/mlcc/__icsFiles/afieldfile/2018/06/20/CL10A105KB8NNNC.pdf; Height: 0.9mm; Manufacturer_Part_Number: CL10A105KB8NNNC; Mouser Part Number: 187-CL10A105KB8NNNC; Mouser Price/Stock: https://www.mouser.co.uk/ProductDetail/Samsung-Electro-Mechanics/CL10A105KB8NNNC?qs=ktYoCbbtCSJz4pFCLWXd5g%3D%3D; Arrow Part Number: CL10A105KB8NNNC; Arrow Price/Stock: https://www.arrow.com/en/products/cl10a105kb8nnnc/samsung-electro-mechanics; JLCPCB Part #: C15849; Package: 0603; JLCPCB Price: 0.0125
C2 C5 C7 C8 C10 C13 C15 C17 C20 C23 C30 C33 C36 C37 C43 C46 C51 C54 C57 C58 C64 C67 C72 C75 C78 C79 C85 C88 = CC0603KRX7R9BB104: Capacitor; Manufacturer_Name: YAGEO (PHYCOMP); Datasheet Link: http://componentsearchengine.com/Datasheets/3/CC0603KRX7R9BB104.pdf; Height: 0.9mm; Manufacturer_Part_Number: CC0603KRX7R9BB104; Arrow Part Number: CC0603KRX7R9BB104; Arrow Price/Stock: https://www.arrow.com/en/products/cc0603krx7r9bb104/yageo; Mouser Part Number: 603-CC603KRX7R9BB104; Mouser Price/Stock: https://www.mouser.co.uk/ProductDetail/Yageo/CC0603KRX7R9BB104?qs=vTakOoo5QyLvVCYM2ge8LQ%3D%3D; JLCPCB Part #: C14663; JLCPCB Price: 0.0066; Package: 0603
C3 C6 C11 C14 C16 C18 C21 C24 C31 C34 C38 C44 C47 C52 C55 C59 C65 C68 C73 C76 C80 C86 C89 = 0603B103K500NT: Capacitor; Manufacturer_Name: Fenghua Advanced Technology (Holding) CO.; Info: X7R ±10% 50V 10nF 0603 Multilayer Ceramic Capacitors MLCC - SMD/SMT ROHS; Datasheet Link: https://www.datasheets360.com/pdf/5043620394403009653; Height: 0.9mm; Manufacturer_Part_Number: 0603B103K500NT; Package: 0603; JLCPCB Price: 0.0049; JLCPCB Basic: Yes; JLCPCB Part #: C57112
C25 C26 = CL21C200JBANNNC: Capacitor; Manufacturer_Name: Samsung Electro-Mechanics; Info: C0G 20pF ±5% 50V 0805 Multilayer Ceramic Capacitors MLCC - SMD/SMT ROHS; Datasheet Link: http://uk.rs-online.com/web/p/products/7665815; Height: 0.75mm; Manufacturer_Part_Number: CL21C200JBANNNC; Mouser Part Number: N/A; Mouser Price/Stock: https://www.mouser.com/Search/Refine.aspx?Keyword=N%2FA; Package: 0805; JLCPCB Price: 0.014; JLCPCB Basic: Yes; JLCPCB Part #: C1798
C27 C48 C69 = CL10B474KA8NNNC: Capacitor; Manufacturer_Name: Samsung Electro-Mechanics; Info: X7R 25V ±10% 470nF 0603 Multilayer Ceramic Capacitors MLCC - SMD/SMT ROHS; Datasheet Link: https://datasheet.lcsc.com/lcsc/1810261513_Samsung-Electro-Mechanics-CL10B474KA8NNNC_C1623.pdf; Height: 0.9mm; Manufacturer_Part_Number: CL10B474KA8NNNC; JLCPCB Part #: C1623; JLCPCB Price: 0.0128; Package: 0603; JLCPCB Basic: Yes
C28 C49 C70 = Cap: Capacitor; Published: 8-Jun-2000; LatestRevisionDate: 17-Jul-2002; LatestRevisionNote: Re-released for DXP Platform.; PackageReference: RAD-0.3; Publisher: Altium Limited; PackageDescription: Radial Cap, Thru-Hole; 2 Leads; 0.3 in Pin Spacing
C35 C39 C56 C60 C77 C81 = CL10B102KB8NNNC: Capacitor; Manufacturer_Name: Samsung Electro-Mechanics; Datasheet Link: https://componentsearchengine.com/Datasheets/2/CL10B102KB8NNNC.pdf; Height: 0.9mm; Manufacturer_Part_Number: CL10B102KB8NNNC; Mouser Part Number: 187-CL10B102KB8NNNC; Mouser Price/Stock: https://www.mouser.co.uk/ProductDetail/Samsung-Electro-Mechanics/CL10B102KB8NNNC?qs=349EhDEZ59ooQTCVhaHrjw%3D%3D; Arrow Part Number: CL10B102KB8NNNC; Arrow Price/Stock: https://www.arrow.com/en/products/cl10b102kb8nnnc/samsung-electro-mechanics?region=nac; JLCPCB Part #: C1588; JLCPCB Price: 0.0074; Package: 0603
C40 C61 C82 = 0603B334K250NT: Capacitor; Manufacturer_Name: FH(Guangdong Fenghua Advanced Tech); Info: X7R 25V ±10% 330nF 0603 Multilayer Ceramic Capacitors MLCC - SMD/SMT ROHS; Datasheet Link: https://datasheet.lcsc.com/lcsc/1811061811_FH-Guangdong-Fenghua-Advanced-Tech-0603B334K250NT_C1615.pdf; Height: 0.9mm; Manufacturer_Part_Number: 0603B334K250NT; JLCPCB Part #: C1615; JLCPCB Price: 0.0226; Package: 0603; JLCPCB Basic: Yes
C41 C62 C83 = CL10B683KB8NNNC: Capacitor; Manufacturer_Name: Samsung Electro-Mechanics; Info: X7R ±10% 68nF 50V 0603 Multilayer Ceramic Capacitors MLCC - SMD/SMT ROHS; Datasheet Link: https://datasheet.lcsc.com/lcsc/1811072020_Samsung-Electro-Mechanics-CL10B683KB8NNNC_C31658.pdf; Height: 0.9mm; Manufacturer_Part_Number: CL10B683KB8NNNC; JLCPCB Part #: C31658; JLCPCB Price: 0.0107; Package: 0603; JLCPCB Basic: Yes
D1 = 1N4148W: Diode; Manufacturer_Name: ON Semiconductor; Manufacturer_Part_Number: MMSD4148T1G; Info: +150℃ (Tj) 150mA - 4ns 1uA 75V 1.25V 150mA Single 400mW 75V SOD-123 Switching Diode ROHS; Datasheet Link: http://www.onsemi.com/pub/Collateral/MMSD4148T1-D.PDF; Height: 1.35mm; Arrow Part Number: MMSD4148T1G; Arrow Price/Stock: https://www.arrow.com/en/products/mmsd4148t1g/on-semiconductor; Mouser Part Number: 863-MMSD4148T1G; Mouser Price/Stock: https://www.mouser.co.uk/ProductDetail/ON-Semiconductor/MMSD4148T1G?qs=P4IOph%252Bbot9zwOmK%2F4hkww%3D%3D; JLCPCB Part #: C81598; JLCPCB Price: 0.017; JLCPCB Basic: Yes; Package: SOD-123
D2 D4 = NCD0805R1: LED; Manufacturer: Foshan NationStar Optoelectronics; Info: Red 615~630nm 0805 Light Emitting Diodes (LED) ROHS; Package: LED_0805; JLCPCB Part #: C84256; Mouser Part #: *; ComponentLink1Description: LCSC Part Link; ComponentLink1URL: https://lcsc.com/product-detail/Light-Emitting-Diodes-LED_Red-LED-SMDLED-80-180mcd_C84256.html/?href=jlc-SMT; ComponentLink2Description: Mouser Part Link; ComponentLink2URL: *; ComponentLink3Description: Datasheet Link; ComponentLink3URL: https://datasheet.lcsc.com/lcsc/2008201032_Foshan-NationStar-Optoelectronics-NCD0805R1_C84256.pdf; JLCPCB Price: 0.0199; MFR.Part #: NCD0805R1
D3 D5 = XL-0805QBC: LED; Manufacturer: Hubei KENTO Elec; Info: 0805 Light Emitting Diodes (LED) RoHS; Package: LED_0805; JLCPCB Part #: C2293; Mouser Part #: *; ComponentLink1Description: LCSC Part Link; ComponentLink1URL: *; ComponentLink2Description: Mouser Part Link; ComponentLink2URL: *; ComponentLink3Description: Datasheet Link; ComponentLink3URL: https://datasheet.lcsc.com/lcsc/1806130620_Hubei-KENTO-Elec-C2293_C2293.pdf; JLCPCB Price: 0.0137; MFR.Part #: XL-0805QBC
GPS1 = GPS-BREAKOUT-V3: GPS
IC1 = MAX6072AAUB50+: Integrated Circuit; Manufacturer_Name: Maxim Integrated; Datasheet Link: https://datasheets.maximintegrated.com/en/ds/MAX6072.pdf; Height: 1.1mm; Manufacturer_Part_Number: MAX6072AAUB50+; Mouser Part Number: 700-MAX6072AAUB50+; Mouser Price/Stock: https://www.mouser.com/Search/Refine.aspx?Keyword=700-MAX6072AAUB50%2B; Package: uMAX-10
IC2 = DSPIC30F4013-30I_P: Integrated Circuit; Manufacturer_Name: Microchip; Manufacturer_Part_Number: DSPIC30F4013-30I/P; Info: 2.5V ~ 5.5V 16-Bit dsPIC 30MIPs FLASH DIP-40 MICROCHIP ROHS; Datasheet Link: https://componentsearchengine.com/Datasheets/2/DSPIC30F4013-30I_P.pdf; Height: 6.35mm; Mouser Part Number: 579-DSPF401330IP; Mouser Price/Stock: https://www.mouser.co.uk/ProductDetail/Microchip-Technology/dsPIC30F4013-30I-P?qs=nMCt4TBfEwr1XpbqL2e4Tw%3D%3D; Arrow Part Number: DSPIC30F4013-30I/P; Arrow Price/Stock: https://www.arrow.com/en/products/dspic30f4013-30ip/microchip-technology?region=nac; JLCPCB Part #: C111958; JLCPCB Basic: No; JLCPCB Price: 7.6237; Package: DIP-40
IC3 = DHT22: Integrated Circuit; Manufacturer_Name: Aosong Electronics; Datasheet Link: https://datasheet4u.com/datasheet-parts/DHT22-datasheet.php?id=792211; Height: 25.1mm; Manufacturer_Part_Number: DHT22
IC4 IC6 IC8 = ADG706BRUZ-REEL7: Integrated Circuit; Manufacturer_Name: Analog Devices; Info: TSSOP-28 Analog Switches & Multiplexers ROHS; Datasheet Link: https://componentsearchengine.com/Datasheets/1/ADG706BRUZ-REEL7.pdf; Height: 1.2mm; Manufacturer_Part_Number: ADG706BRUZ-REEL7; Mouser Part Number: 584-ADG706BRUZ-R7; Mouser Price/Stock: https://www.mouser.co.uk/ProductDetail/Analog-Devices/ADG706BRUZ-REEL7?qs=BpaRKvA4VqGGcUVhZYQVqg%3D%3D; Arrow Part Number: ADG706BRUZ-REEL7; Arrow Price/Stock: https://www.arrow.com/en/products/adg706bruz-reel7/analog-devices?region=nac; Package: TSSOP-28_4.4x9.7x0.65P; JLCPCB Price: 8.6662; JLCPCB Basic: No; JLCPCB Part #: C408400
IC5 IC7 IC9 = INA114AP: Integrated Circuit; Manufacturer_Name: Texas Instruments; Info: 1MHz 1 Instrumentation - 0.6 V/us 4.5V ~ 36V, ±2.25V ~ 18V DIP-8 Instrumentation OpAmps ROHS; Datasheet Link: http://www.ti.com/lit/ds/symlink/ina114.pdf; Height: 5.08mm; Manufacturer_Part_Number: INA114AP; Mouser Part Number: 595-INA114AP; Mouser Price/Stock: https://www.mouser.co.uk/ProductDetail/Texas-Instruments/INA114AP?qs=VBduBm9rCJQ83rY0xAdPIQ%3D%3D; Arrow Part Number: INA114AP; Arrow Price/Stock: https://www.arrow.com/en/products/ina114ap/texas-instruments; JLCPCB Part #: C38890; JLCPCB Basic: No; JLCPCB Price: 8.1654; Package: DIP-8_L9.2-W6.4-P2.54-LS8.7-BL
J1 = PEINETA-2x10P: Conector; Manufacturer_Name: Molex; Manufacturer_Part_Number: 0010897200; Datasheet Link: http://www.molex.com/pdm_docs/sd/010897200_sd.pdf; Height: 8.64mm; Mouser Part Number: N/A; Mouser Price/Stock: https://www.mouser.com/Search/Refine.aspx?Keyword=N%2FA; Arrow Part Number: 0010897200; Arrow Price/Stock: https://www.arrow.com/en/products/0010897200/molex
J2 = PEINETA-2X20P: Connector; Manufacturer_Name: TE Connectivity; Manufacturer_Part_Number: 2-826656-0; Datasheet Link: http://www.te.com/commerce/DocumentDelivery/DDEController?Action=srchrtrv&DocNm=826629&DocType=Customer+Drawing&DocLang=English; Height: 8.6mm; Mouser Part Number: 571-2-826656-0; Mouser Price/Stock: https://www.mouser.co.uk/ProductDetail/TE-Connectivity/2-826656-0?qs=DbJIyW2JsP5LY4FmR2by3A%3D%3D; Arrow Part Number: 2-826656-0; Arrow Price/Stock: https://www.arrow.com/en/products/2-826656-0/te-connectivity
P1 = PEINETA-8X1P: Conector
P2 P5 = PEINETA-6X1P: Conector
P3 = MOLEX-6P: Conector
P4 = MOLEX-4P: Conector
Q1-Q13 = 2N7002: MOSFET (N-Channel); Manufacturer_Name: Vishay; Info: 2.5V 250uA 0.115A 60V N Channel 7.5Ω 500mA,10V 0.2W SOT-23(SOT-23-3) MOSFETs ROHS; Datasheet Link: https://www.diodes.com/assets/Datasheets/ds11303.pdf; Height: 1.2mm; Manufacturer_Part_Number: 2N7002; Mouser Part Number: 781-2N7002; Mouser Price/Stock: https://www.mouser.co.uk/ProductDetail/Vishay-Siliconix/2N7002?qs=xBpwZ0JX2zKeuvZKtdYLZQ%3D%3D; JLCPCB Part #: C8545; JLCPCB Price: 0.0271; JLCPCB Basic: Yes; Package: SOT-23-3
R1 R6 R10 R18 R57 R91 R125 = 0805W8F100JT5E: Resistor; Manufacturer_Name: UNI-ROYAL(Uniroyal Elec); Info: ±1% 10Ω ±400ppm/℃ 0.125W 0805 Chip Resistor - Surface Mount ROHS; Datasheet Link: https://datasheet.lcsc.com/lcsc/2110251730_UNI-ROYAL-Uniroyal-Elec-0805W8F100JT5E_C17415.pdf; Height: 0.65mm; Manufacturer_Part_Number: 0805W8F100JT5E; Package: 0805; JLCPCB Price: 0.0043; JLCPCB Basic: Yes; JLCPCB Part #: C17415
R2 R3 R7 R19 R28 R65 R99 R133 = 0805W8F4701T5E: Resistor; Manufacturer_Name: UNI-ROYAL(Uniroyal Elec); Info: ±1% 4.7kΩ ±100ppm/℃ 0.125W 0805 Chip Resistor - Surface Mount ROHS; Datasheet Link: https://datasheet.lcsc.com/lcsc/1808281533_UNI-ROYAL-Uniroyal-Elec-0805W8F4701T5E_C17673.pdf; Height: 0.65mm; Manufacturer_Part_Number: 0805W8F4701T5E; JLCPCB Part #: C17673; JLCPCB Basic: Yes; JLCPCB Price: 0.0043; Package: 0805
R4 R5 R8 R9 R11 R12 R14-R17 R20-R23 R25 R26 R33-R44 R69 R74 R79 R80 R103 R108 R113 R114 R137 R142 R147 R148 = 0805W8F1001T5E: Resistor; Manufacturer_Name: UNI-ROYAL(Uniroyal Elec); Info: ±1% ±100ppm/℃ 1kΩ 0.125W 0805 Chip Resistor - Surface Mount ROHS; Datasheet Link: https://datasheet.lcsc.com/lcsc/1811022111_UNI-ROYAL-Uniroyal-Elec-0805W8F1001T5E_C17513.pdf; Height: 0.65mm; Manufacturer_Part_Number: 0805W8F1001T5E; JLCPCB Part #: C17513; JLCPCB Basic: Yes; JLCPCB Price: 0.0046; Package: 0805
R13 = 0603WAF4701T5E: Resistor; Manufacturer: UNI-ROYAL(Uniroyal Elec); ComponentLink1Description: LCSC Part Link; ComponentLink1URL: *; ComponentLink2Description: Mouser Part Link; ComponentLink2URL: *; ComponentLink3Description: Datasheet Link; ComponentLink3URL: https://datasheet.lcsc.com/lcsc/1811021212_UNI-ROYAL-Uniroyal-Elec-0603WAF5101T5E_C23186.pdf; MFR.Part #: 0603WAF4701T5E; Mouser Part #: *; JLCPCB Part #: C23162; JLCPCB Price: 0.0025; Package: 0603
R24 = 0805W8F1002T5E: Resistor; Manufacturer: UNI-ROYAL(Uniroyal Elec); JLCPCB Part #: C17414; Package: 0805; Mouser Part #: *; Height: *; JLCPCB Price: 0.0037; ComponentLink1Description: LCSC Part Link; ComponentLink1URL: https://lcsc.com/product-detail/Chip-Resistor-Surface-Mount_Uniroyal-Elec-0805W8F1002T5E_C17414.html/?href=jlc-SMT; ComponentLink2Description: Mouser Part Link; ComponentLink2URL: *; ComponentLink3Description: Datasheet Link; ComponentLink3URL: https://datasheet.lcsc.com/szlcsc/Uniroyal-Elec-0805W8F1002T5E_C17414.pdf; MFR.Part #: 0805W8F1002T5E
R27 R29-R32 R45-R48 R63 R77 R78 R81 R82 R97 R111 R112 R115 R116 R131 R145 R146 = 0805W8F470JT5E: Resistor; Manufacturer_Name: UNI-ROYAL(Uniroyal Elec); Info: ±1% ±200ppm/℃ 47Ω 0.125W 0805 Chip Resistor - Surface Mount ROHS; Datasheet Link: https://datasheet.lcsc.com/szlcsc/Uniroyal-Elec-0805W8F470JT5E_C17714.pdf; Height: 0.65mm; Manufacturer_Part_Number: 0805W8F470JT5E; JLCPCB Part #: C17714; JLCPCB Basic: Yes; JLCPCB Price: 0.0042; Package: 0805
R49 R50 R67 R75 R76 R83 R84 R101 R109 R110 R117 R118 R135 R143 R144 = 0805W8F1000T5E: Resistor; Manufacturer_Name: UNI-ROYAL(Uniroyal Elec); Info: ±1% ±100ppm/℃ 100Ω 0.125W 0805 Chip Resistor - Surface Mount ROHS; Datasheet Link: https://datasheet.lcsc.com/szlcsc/Uniroyal-Elec-0805W8F1000T5E_C17408.pdf; Height: 0.65mm; Manufacturer_Part_Number: 0805W8F1000T5E; JLCPCB Part #: C17408; JLCPCB Basic: Yes; JLCPCB Price: 0.0042; Package: 0805
R51 R85 R119 = 0805W8F8200T5E: Resistor; Manufacturer_Name: UNI-ROYAL(Uniroyal Elec); Info: ±1% ±100ppm/℃ 0.125W 820Ω 0805 Chip Resistor - Surface Mount ROHS; Datasheet Link: https://datasheet.lcsc.com/szlcsc/Uniroyal-Elec-0805W8F8200T5E_C17837.pdf; Height: 0.65mm; Manufacturer_Part_Number: 0805W8F8200T5E; JLCPCB Part #: C17837; JLCPCB Basic: Yes; JLCPCB Price: 0.0044; Package: 0805
R52-R54 R60 R68 R71 R86-R88 R94 R102 R105 R120-R122 R128 R136 R139 = Res1: Resistor; Published: 8-Jun-2000; LatestRevisionDate: 17-Jul-2002; LatestRevisionNote: Re-released for DXP Platform.; PackageReference: AXIAL-0.3; Publisher: Altium Limited; PackageDescription: Axial Device, Thru-Hole; 2 Leads; 0.3 in Pin Spacing
R55 R61 R89 R95 R123 R129 = 0805W8F3301T5E: Resistor; Manufacturer_Name: UniOhm; Info: 3.3kΩ ±1% ±100ppm/℃ 0.125W 0805 Chip Resistor - Surface Mount ROHS; Datasheet Link: https://datasheet.lcsc.com/szlcsc/Uniroyal-Elec-0805W8F3301T5E_C26010.pdf; Height: 0.65mm; Manufacturer_Part_Number: 0805W8F3301T5E; JLCPCB Part #: C26010; JLCPCB Basic: Yes; JLCPCB Price: 0.0046; Package: 0805
R56 R72 R90 R106 R124 R140 = 0805W8F2002T5E: Resistor; Manufacturer_Name: Uniroyal Elec; Info: ±1% ±100ppm/℃ 20kΩ 0.125W 0805 Chip Resistor - Surface Mount ROHS; Datasheet Link: https://datasheet.lcsc.com/lcsc/1809271724_UNI-ROYAL-Uniroyal-Elec-0805W8F2002T5E_C4328.pdf; Height: 0.65mm; Manufacturer_Part_Number: 0805W8F2002T5E; Package: 0805; JLCPCB Price: 0.0042; JLCPCB Basic: Yes; JLCPCB Part #: C4328
R58 R92 R126 = 0805W8F6801T5E: Resistor; Manufacturer_Name: UNI-ROYAL(Uniroyal Elec); Info: 6.8kΩ ±1% ±100ppm/℃ 0.125W 0805 Chip Resistor - Surface Mount ROHS; Datasheet Link: https://datasheet.lcsc.com/lcsc/1810301621_UNI-ROYAL-Uniroyal-Elec-0805W8F6801T5E_C17772.pdf; Height: 0.65mm; Manufacturer_Part_Number: 0805W8F6801T5E; JLCPCB Part #: C17772; JLCPCB Basic: Yes; JLCPCB Price: 0.0045; Package: 0805
R59 R93 R127 = 0805W8F220JT5E: Resistor; Manufacturer_Name: Uniroyal Elec; Info: ±1% ±200ppm/℃ 22Ω 0.125W 0805 Chip Resistor - Surface Mount ROHS; Datasheet Link: https://datasheet.lcsc.com/szlcsc/Uniroyal-Elec-0805W8F220JT5E_C17561.pdf; Height: 0.65mm; Manufacturer_Part_Number: 0805W8F220JT5E; Package: 0805; JLCPCB Price: 0.0042; JLCPCB Basic: Yes; JLCPCB Part #: C17561
R62 R96 R130 = 0805W8F8201T5E: Resistor; Manufacturer_Name: UNI-ROYAL(Uniroyal Elec); Info: ±1% ±100ppm/℃ 8.2kΩ 0.125W 0805 Chip Resistor - Surface Mount ROHS; Datasheet Link: https://datasheet.lcsc.com/lcsc/1810301623_UNI-ROYAL-Uniroyal-Elec-0805W8F8201T5E_C17828.pdf; Height: 0.65mm; Manufacturer_Part_Number: 0805W8F8201T5E; JLCPCB Part #: C17828; JLCPCB Basic: Yes; JLCPCB Price: 0.0042; Package: 0805
R64 R98 R132 = 0805W8F4992T5E: Resistor; Manufacturer_Name: UNI-ROYAL(Uniroyal Elec); Info: ±1% 49.9kΩ ±100ppm/℃ 0.125W 0805 Chip Resistor - Surface Mount ROHS; Datasheet Link: https://datasheet.lcsc.com/lcsc/1810301830_UNI-ROYAL-Uniroyal-Elec-0805W8F4992T5E_C17719.pdf; Height: 0.65mm; Manufacturer_Part_Number: 0805W8F4992T5E; JLCPCB Part #: C17719; JLCPCB Basic: Yes; JLCPCB Price: 0.0046; Package: 0805
R66 R100 R134 = 0805W8F1802T5E: Resistor; Manufacturer_Name: UNI-ROYAL(Uniroyal Elec); Info: 18kΩ ±1% ±100ppm/℃ 0.125W 0805 Chip Resistor - Surface Mount ROHS; Datasheet Link: https://datasheet.lcsc.com/lcsc/1810301816_UNI-ROYAL-Uniroyal-Elec-0805W8F1802T5E_C17506.pdf; Height: 0.65mm; Manufacturer_Part_Number: 0805W8F1802T5E; JLCPCB Part #: C17506; JLCPCB Basic: Yes; JLCPCB Price: 0.0041; Package: 0805
R70 R104 R138 = 0805W8F1800T5E: Resistor; Manufacturer_Name: UNI-ROYAL(Uniroyal Elec); Info: ±1% ±100ppm/℃ 180Ω 0.125W 0805 Chip Resistor - Surface Mount ROHS; Datasheet Link: https://datasheet.lcsc.com/lcsc/1810301611_UNI-ROYAL-Uniroyal-Elec-0805W8F1800T5E_C25270.pdf; Height: 0.65mm; Manufacturer_Part_Number: 0805W8F1800T5E; Package: 0805; JLCPCB Price: 0.0043; JLCPCB Basic: Yes; JLCPCB Part #: C25270
R73 R107 R141 = 0805W8F3900T5E: Resistor; Manufacturer_Name: UNI-ROYAL(Uniroyal Elec); Info: ±1% 390Ω ±100ppm/℃ 0.125W 0805 Chip Resistor - Surface Mount ROHS; Datasheet Link: https://datasheet.lcsc.com/szlcsc/Uniroyal-Elec-0805W8F3900T5E_C17655.pdf; Height: 0.65mm; Manufacturer_Part_Number: 0805W8F3900T5E; Package: 0805; JLCPCB Price: 0.0044; JLCPCB Basic: Yes; JLCPCB Part #: C17655
U1 = DS3231S#: Undefined or Miscellaneous; Manufacturer_Name: Maxim Integrated; Info: YY-MM-DD-dd HH:MM:SS (12/24 hr) I2C, 2-Wire Serial - Clock/Calendar SOIC-16_300mil Real-time Clocks ROHS; Datasheet Link: https://datasheets.maximintegrated.com/en/ds/DS3231.pdf; Height: 2.65mm; Manufacturer_Part_Number: DS3231S#; Mouser Part Number: 700-DS3231S#; Mouser Price/Stock: https://www.mouser.co.uk/ProductDetail/Maxim-Integrated/DS3231S?qs=1eQvB6Dk1vjWzhQl%252Bd1TBA%3D%3D; JLCPCB Part #: C2651514; JLCPCB Price: 6.9493; Package: SOIC-16_7.5x10.3x1.27P
U2-U4 = TL084IDR: Integrated Circuit Operational Amplifier; Manufacturer_Name: Texas Instruments; Info: 3MHz 4 J-FET 1.4mA 13 V/us 7V~36V,±3.5V~18V SOIC-14_150mil FET InputAmplifiers ROHS; Datasheet Link: http://www.ti.com/lit/ds/symlink/tl082.pdf; Height: 1.75mm; Manufacturer_Part_Number: TL084IDR; Mouser Part Number: 595-TL084IDR; Mouser Price/Stock: https://www.mouser.co.uk/ProductDetail/Texas-Instruments/TL084IDR?qs=UGVLDq%2F29uhRaWn16yu8Iw%3D%3D; Arrow Part Number: TL084IDR; Arrow Price/Stock: https://www.arrow.com/en/products/tl084idr/texas-instruments?region=nac; JLCPCB Part #: C12601; JLCPCB Basic: No; JLCPCB Price: 0.3879; Package: SOIC-14_3.9x8.7x1.27P
Y1 = ECS-150-S-4X: Crystal or Oscillator; Manufacturer_Name: ECS; Value: 15MHz; Datasheet Link: https://www.mouser.com/datasheet/2/122/hc_49usx-791.pdf; Height: 3.5mm; Manufacturer_Part_Number: ECS-150-S-4X; Mouser Part Number: 520-HCU1500-SX; Mouser Price/Stock: https://www.mouser.co.uk/ProductDetail/ECS/ECS-150-S-4X?qs=CNVyLAqdhH0ApkrFVt8qwg%3D%3D